# Altium schematic sheet SPI FLASH.SchDoc
size Letter; SheetNumber: 9; SheetTotal: 22
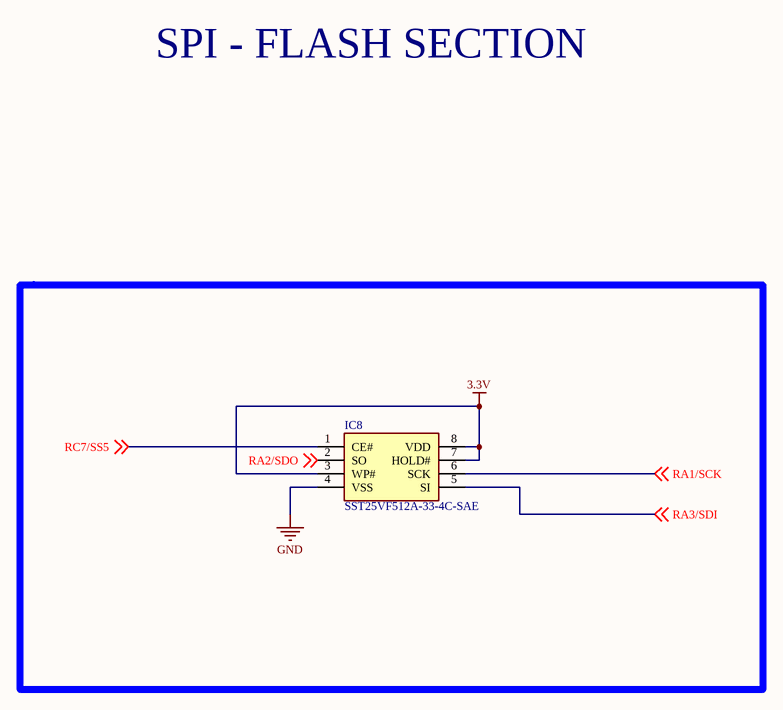
[diagram p0: SPI FLASH.SchDoc]

## Parts
IC8  SST25VF512A-33-4C-SAE  [SOIC127P600X175-8N]

## Nets
3.3V: IC8.3(WP#) IC8.7(HOLD#) IC8.8(VDD)
GND: IC8.4(VSS)
RA1/SCK: IC8.6(SCK) ; off-sheet RA1/SCK
RA2/SDO: IC8.2(SO) ; off-sheet RA2/SDO
RA3/SDI: IC8.5(SI) ; off-sheet RA3/SDI
RC7/SS5: IC8.1(CE#) ; off-sheet RC7/SS5

## Notes on the sheet
- SPI - FLASH SECTION

## Library data of the parts
IC8 = SST25VF512A-33-4C-SAE: Integrated Circuit; Manufacturer_Name: Microchip; Datasheet Link: http://ww1.microchip.com/downloads/en/DeviceDoc/25090A.pdf; Height: 1.75mm; Manufacturer_Part_Number: SST25VF512A-33-4C-SAE; Mouser Part Number: 804-25VF512A3CSAE; Mouser Price/Stock: https://www.mouser.co.uk/ProductDetail/Microchip-Technology/SST25VF512A-33-4C-SAE?qs=sPPKN8MmjErx4W822Eh6pg%3D%3D; Arrow Part Number: SST25VF512A-33-4C-SAE; Arrow Price/Stock: https://www.arrow.com/en/products/sst25vf512a-33-4c-sae/microchip-technology?region=nac